# EAGLE design 2009_12_01_sevenSegmentWatch_01_01 (EAGLE 4.16)

## Sheet 1 of 2
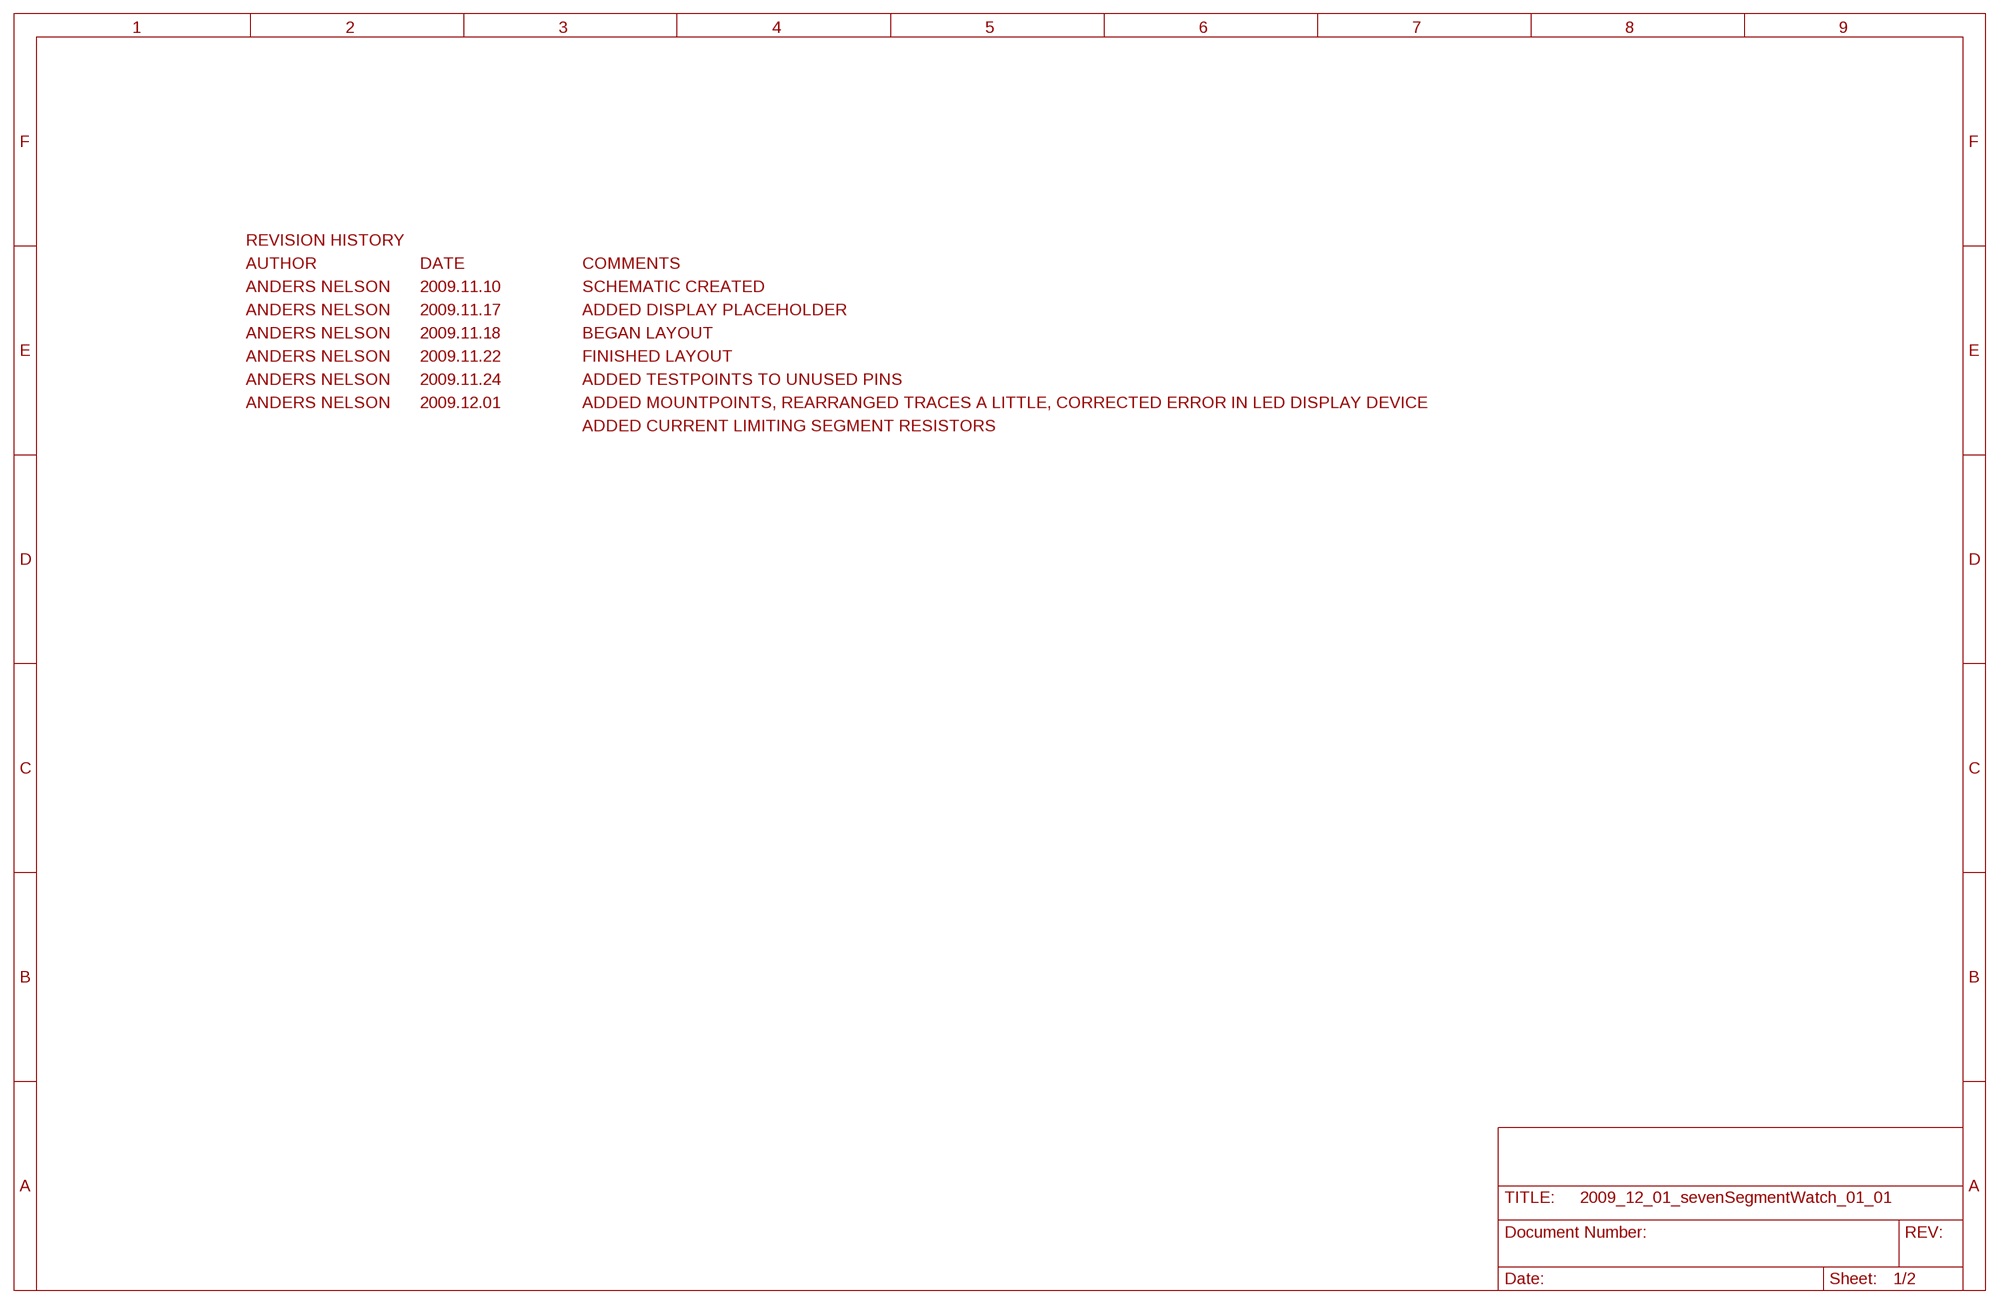
[diagram p0: schematic, sheet 1]

### Notes on the sheet
- REVISION HISTORY
- AUTHOR | DATE | COMMENTS
- ANDERS NELSON | 2009.11.10 | SCHEMATIC CREATED
- ANDERS NELSON | 2009.11.17 | ADDED DISPLAY PLACEHOLDER
- ANDERS NELSON | 2009.11.18 | BEGAN LAYOUT
- ANDERS NELSON | 2009.11.22 | FINISHED LAYOUT
- ANDERS NELSON | 2009.11.24 | ADDED TESTPOINTS TO UNUSED PINS
- ANDERS NELSON | 2009.12.01 | ADDED MOUNTPOINTS, REARRANGED TRACES A LITTLE, CORRECTED ERROR IN LED DISPLAY DEVICE
- ADDED CURRENT LIMITING SEGMENT RESISTORS

## Sheet 2 of 2
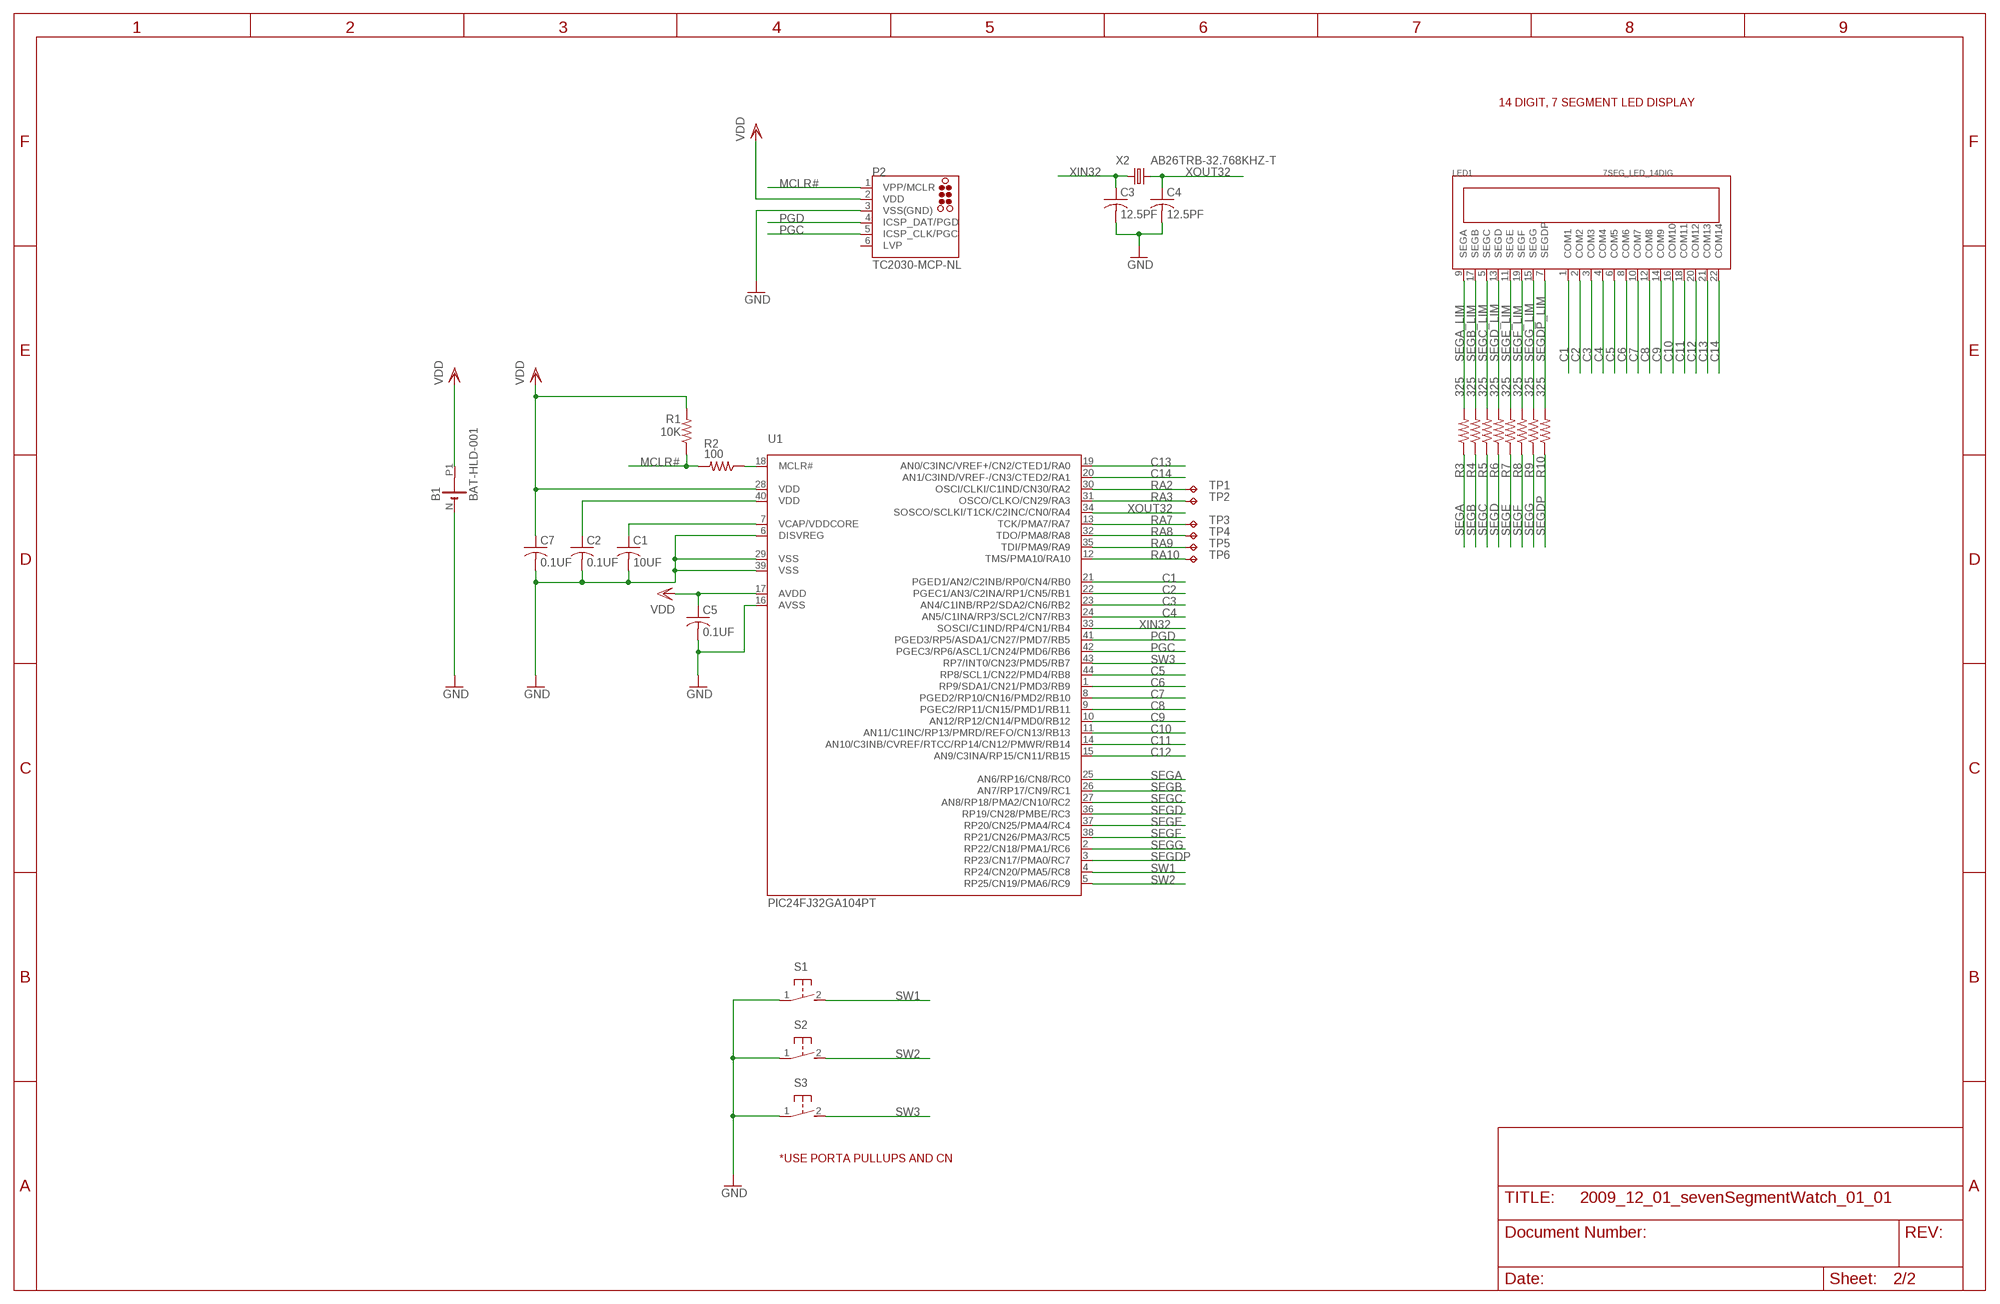
[diagram p1: schematic, sheet 2]

### Parts
B1  BAT-HLD-001  [BAT-HLD-001]
C1  10UF  C-USC0603  [C0603]
C2  0.1UF  C-USC0603  [C0603]
C3  12.5PF  C-USC0603  [C0603]
C4  12.5PF  C-USC0603  [C0603]
C5  0.1UF  C-USC0603  [C0603]
C7  0.1UF  C-USC0603  [C0603]
LED1  7SEG_LED_14DIG  [7SEG_LED_14DIG]
P2  TC2030-MCP-NL  [TC2030-MCP-NL]
R1  10K  R-US_R0603  [R0603]
R2  100  R-US_R0603  [R0603]
R3  325  R-US_R0402  [R0402]
R4  325  R-US_R0402  [R0402]
R5  325  R-US_R0402  [R0402]
R6  325  R-US_R0402  [R0402]
R7  325  R-US_R0402  [R0402]
R8  325  R-US_R0402  [R0402]
R9  325  R-US_R0402  [R0402]
R10  325  R-US_R0402  [R0402]
S1  31-XX  [B3F-31XX]
S2  31-XX  [B3F-31XX]
S3  31-XX  [B3F-31XX]
TP1  TPB1,27  [B1,27]
TP2  TPB1,27  [B1,27]
TP3  TPB1,27  [B1,27]
TP4  TPB1,27  [B1,27]
TP5  TPB1,27  [B1,27]
TP6  TPB1,27  [B1,27]
U1  PIC24FJ32GA104PT  [TQFP44]
X2  AB26TRB-32.768KHZ-T  [CYL_6MM_2MM_SMD]

### Nets
C1: LED1.1(COM1) U1.21(PGED1/AN2/C2INB/RP0/CN4/RB0)
C2: LED1.2(COM2) U1.22(PGEC1/AN3/C2INA/RP1/CN5/RB1)
C3: LED1.3(COM3) U1.23(AN4/C1INB/RP2/SDA2/CN6/RB2)
C4: LED1.4(COM4) U1.24(AN5/C1INA/RP3/SCL2/CN7/RB3)
C5: LED1.6(COM5) U1.44(RP8/SCL1/CN22/PMD4/RB8)
C6: LED1.8(COM6) U1.1(RP9/SDA1/CN21/PMD3/RB9)
C7: LED1.10(COM7) U1.8(PGED2/RP10/CN16/PMD2/RB10)
C8: LED1.12(COM8) U1.9(PGEC2/RP11/CN15/PMD1/RB11)
C9: LED1.14(COM9) U1.10(AN12/RP12/CN14/PMD0/RB12)
C10: LED1.16(COM10) U1.11(AN11/C1INC/RP13/PMRD/REFO/CN13/RB13)
C11: LED1.18(COM11) U1.14(AN10/C3INB/CVREF/RTCC/RP14/CN12/PMWR/RB14)
C12: LED1.20(COM12) U1.15(AN9/C3INA/RP15/CN11/RB15)
C13: LED1.21(COM13) U1.19(AN0/C3INC/VREF+/CN2/CTED1/RA0)
C14: LED1.22(COM14) U1.20(AN1/C3IND/VREF-/CN3/CTED2/RA1)
GND: B1.N(-) C1.2 C2.2 C3.2 C4.2 C5.2 C7.2 P2.3(VSS(GND)) S1.1(P) S2.1(P) S3.1(P) U1.6(DISVREG) U1.16(AVSS) U1.29(VSS) U1.39(VSS)
MCLR#: P2.1(VPP/MCLR) R1.1 R2.2
N$1: C2.1 U1.40(VDD)
N$2: R2.1 U1.18(MCLR#)
N$7: C1.1 U1.7(VCAP/VDDCORE)
PGC: P2.5(ICSP_CLK/PGC) U1.42(PGEC3/RP6/ASCL1/CN24/PMD6/RB6)
PGD: P2.4(ICSP_DAT/PGD) U1.41(PGED3/RP5/ASDA1/CN27/PMD7/RB5)
RA2: TP1.PP(TP) U1.30(OSCI/CLKI/C1IND/CN30/RA2)
RA3: TP2.PP(TP) U1.31(OSCO/CLKO/CN29/RA3)
RA7: TP3.PP(TP) U1.13(TCK/PMA7/RA7)
RA8: TP4.PP(TP) U1.32(TDO/PMA8/RA8)
RA9: TP5.PP(TP) U1.35(TDI/PMA9/RA9)
RA10: TP6.PP(TP) U1.12(TMS/PMA10/RA10)
SEGA: R3.1 U1.25(AN6/RP16/CN8/RC0)
SEGA_LIM: LED1.9(SEGA) R3.2
SEGB: R4.1 U1.26(AN7/RP17/CN9/RC1)
SEGB_LIM: LED1.17(SEGB) R4.2
SEGC: R5.1 U1.27(AN8/RP18/PMA2/CN10/RC2)
SEGC_LIM: LED1.5(SEGC) R5.2
SEGD: R6.1 U1.36(RP19/CN28/PMBE/RC3)
SEGD_LIM: LED1.13(SEGD) R6.2
SEGDP: R10.1 U1.3(RP23/CN17/PMA0/RC7)
SEGDP_LIM: LED1.7(SEGDP) R10.2
SEGE: R7.1 U1.37(RP20/CN25/PMA4/RC4)
SEGE_LIM: LED1.11(SEGE) R7.2
SEGF: R8.1 U1.38(RP21/CN26/PMA3/RC5)
SEGF_LIM: LED1.19(SEGF) R8.2
SEGG: R9.1 U1.2(RP22/CN18/PMA1/RC6)
SEGG_LIM: LED1.15(SEGG) R9.2
SW1: S1.2(S) U1.4(RP24/CN20/PMA5/RC8)
SW2: S2.2(S) U1.5(RP25/CN19/PMA6/RC9)
SW3: S3.2(S) U1.43(RP7/INT0/CN23/PMD5/RB7)
VDD: B1.P1(+) C5.1 C7.1 P2.2(VDD) R1.2 U1.17(AVDD) U1.28(VDD)
XIN32: C3.1 U1.33(SOSCI/C1IND/RP4/CN1/RB4) X2.3
XOUT32: C4.1 U1.34(SOSCO/SCLKI/T1CK/C2INC/CN0/RA4) X2.2
Unconnected: B1.P2(+) P2.6(LVP)

### Notes on the sheet
- 14 DIGIT, 7 SEGMENT LED DISPLAY
- *USE PORTA PULLUPS AND CN

## Library data of the parts
B1 = sevenSegmentWatch:BAT-HLD-001
C1-C5 C7 = rcl:C-US: CAPACITOR, American symbol
LED1 = sevenSegmentWatch:7SEG_LED_14DIG
P2 = raveGearControl:TC2030: TAG-CONNECT ISP Connector Manufacturer: Tag-Connect <www.tag-connect.com> Cable for easy In-Circuit PCB Programming. Designed for Microchip ICD2, suitable for many others. Two variants - one "with legs" (for hads-free fit on PCB) and another "without legs" for quick programming. PAD Description 1 MCLR/Vpp 2 Vdd 3 GND 4 PGD (ISPDAT) 5 PGC (ISPCLK) 6 nc (used for LVP) ©2009 ROFA.cz
R1-R10 = rcl:R-US_: RESISTOR, American symbol
S1-S3 = switch-omron:31-XX: OMRON SWITCH
TP1-TP6 = testpad:TP
U1 = sevenSegmentWatch:PIC24FJ*
X2 = raveGearControl2:AB26TRB-32.768KHZ-T

## Board
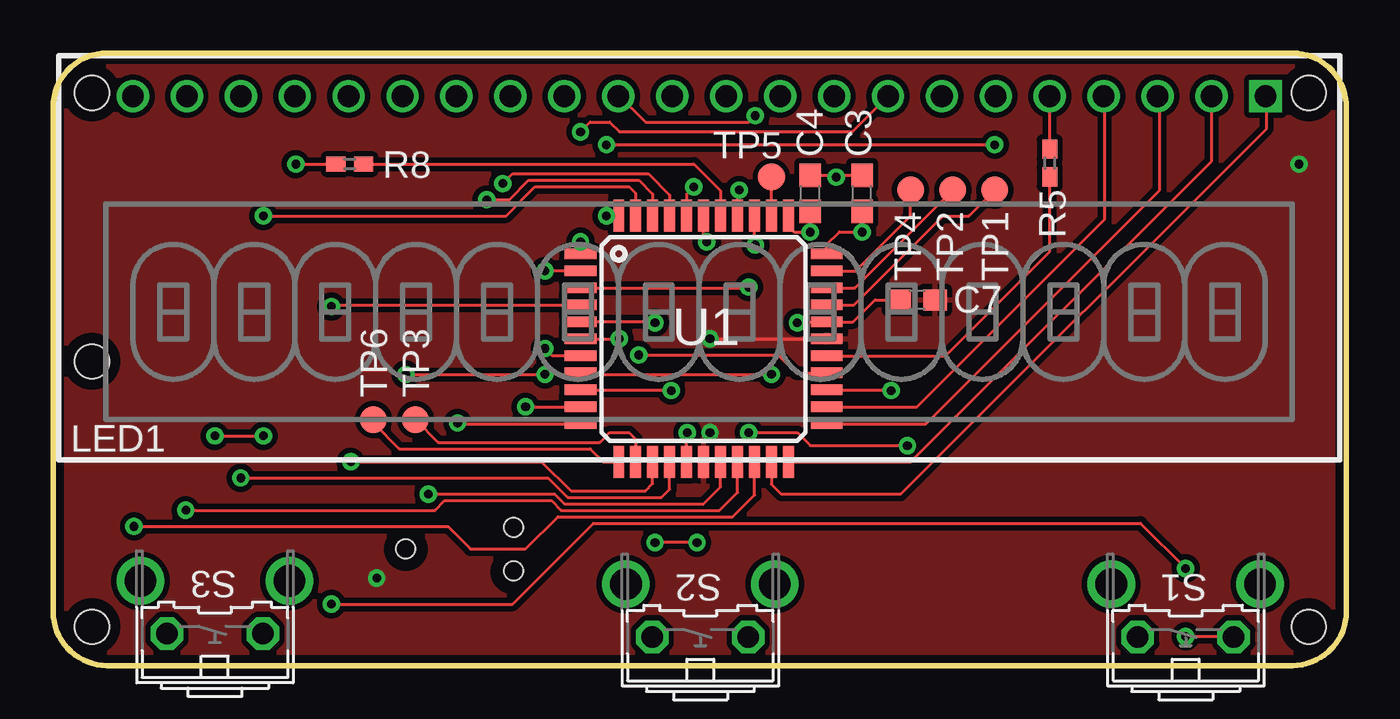
[diagram p2: board, top side]
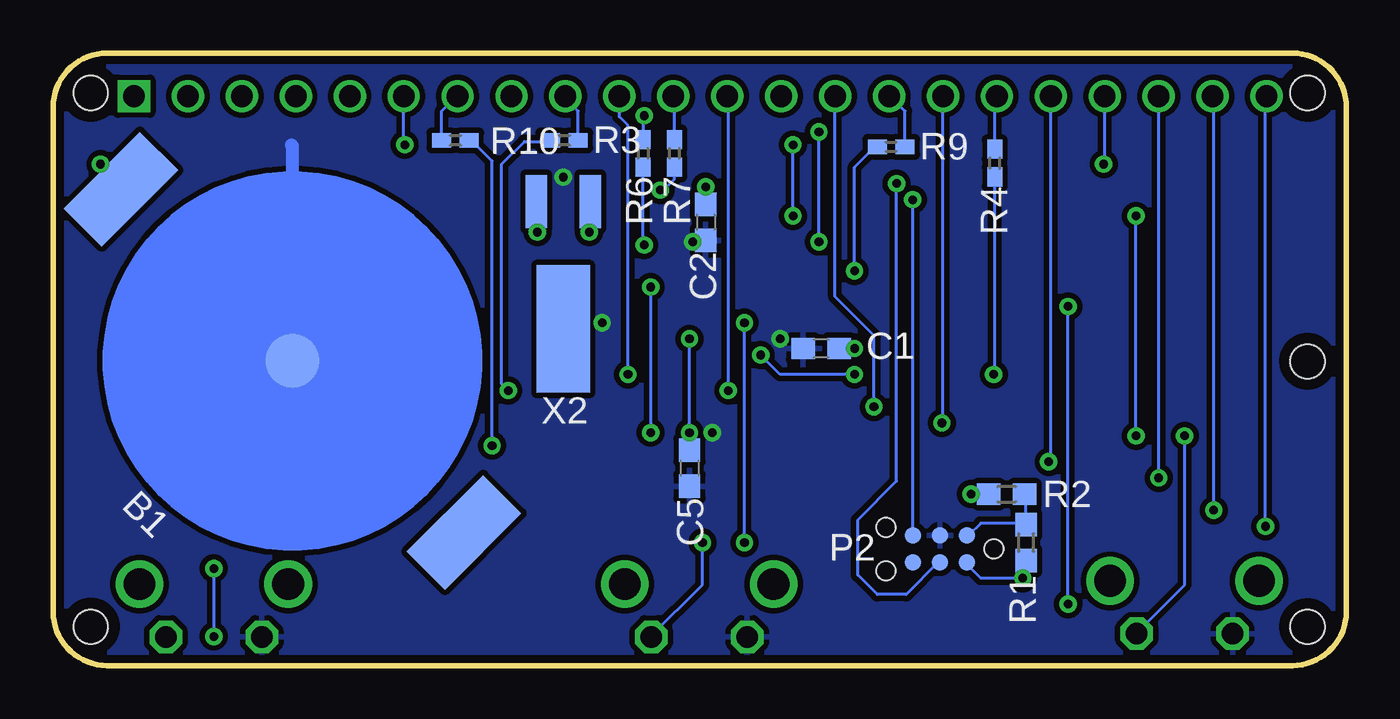
[diagram p3: board, bottom side, seen from below]

Size 60.91 x 28.85 mm. Coordinates in mm from the lower left corner, seen from the top.
Outline: 58.37,0 arc90 60.91,2.54 60.91,26.31 arc90 58.37,28.85 2.54,28.85 arc90 0,26.31 0,2.54 arc90 2.54,0 58.37,0
Copper layers (1*16): Top 0.0356mm / dielectric 0.2007mm / Bottom 0.0356mm
Design rules "PCBExpress_E2": minimum track width 6mil, minimum drill 16mil, track to track 6mil, track to pad 6mil, pad to pad 6mil, via to via 6mil, smd to smd 0mil, copper to edge 15mil, drill to drill 8mil, minimum pad ring 10mil, minimum via ring 8mil, stop-mask expansion 4mil, vias tented up to drill 16mil, thermal gap 10mil
Holes 1.6 mm at 1.83,1.83 59.13,1.83 59.13,26.97 1.83,26.97 1.83,14.33
tRestrict: area 20.9,5.8 to 22.4,7.3; area 20.9,3.6 to 22.4,5.2; area 15.8,4.7 to 17.4,6.3; area 0.8,0.8 to 2.9,2.9; area 58.1,0.8 to 60.2,2.9; area 58.1,25.9 to 60.2,28; area 0.8,25.9 to 2.9,28.1; area 0.8,13.2 to 2.9,15.4
bRestrict: area 20.9,5.8 to 22.4,7.3; area 20.9,3.6 to 22.4,5.2; area 15.8,4.7 to 17.4,6.2; area 0.7,25.9 to 2.9,28.1; area 58,25.9 to 60.2,28.1; area 58,0.7 to 60.2,2.9; area 0.8,0.8 to 2.9,2.9; area 0.8,13.2 to 2.9,15.4

### Footprints (pad centres in the part's own frame; a part is rotated, then mirrored left to right if it is on the bottom)
BAT-HLD-001 = smd 2.54 x 2.54: N 0,0 | smd 2.54 x 5.08: P1 -11.43,0; P2 11.43,0
C0603 = smd 1.1 x 1: 1 -0.85,0; 2 0.85,0
7SEG_LED_14DIG = drill 1.016 square: 1 -26.67,-7.62 | drill 1.016 round: 2 -24.13,-7.62; 3 -21.59,-7.62; 4 -19.05,-7.62; 5 -16.51,-7.62; 6 -13.97,-7.62; 7 -11.43,-7.62; 8 -8.89,-7.62; 9 -6.35,-7.62; 10 -3.81,-7.62; 11 -1.27,-7.62; 12 1.27,-7.62; 13 3.81,-7.62; 14 6.35,-7.62; 15 8.89,-7.62; 16 11.43,-7.62; 17 13.97,-7.62; 18 16.51,-7.62; 19 19.05,-7.62; 20 21.59,-7.62; 21 24.13,-7.62; 22 26.67,-7.62
TC2030-MCP-NL = smd 0.787 x 0.787: 1 1.27,-0.635; 2 1.27,0.635; 3 2.54,-0.635; 4 2.54,0.635; 5 3.81,-0.635; 6 3.81,0.635 | hole 0.889: 0,0; 5.08,-1.016; 5.08,1.016
R0603 = smd 1.1 x 1: 1 -0.85,0; 2 0.85,0
R0402 = smd 0.9 x 0.7: 1 -0.65,0; 2 0.65,0
B3F-31XX = drill 1.016 octagon: 1 -2.261,-1.245; 2 2.261,-1.245 | drill 1.499 pad 2.159 round: 3 -3.505,1.245; 4 3.505,1.245
B1,27 = smd 1.27 x 1.27: PP 0,0
TQFP44 = smd 1.5 x 0.5: 1 -5.8,4; 2 -5.8,3.2; 3 -5.8,2.4; 4 -5.8,1.6; 5 -5.8,0.8; 6 -5.8,0; 7 -5.8,-0.8; 8 -5.8,-1.6; 9 -5.8,-2.4; 10 -5.8,-3.2; 11 -5.8,-4; 23 5.8,-4; 24 5.8,-3.2; 25 5.8,-2.4; 26 5.8,-1.6; 27 5.8,-0.8; 28 5.8,0; 29 5.8,0.8; 30 5.8,1.6; 31 5.8,2.4; 32 5.8,3.2; 33 5.8,4 | smd 0.5 x 1.5: 12 -4,-5.8; 13 -3.2,-5.8; 14 -2.4,-5.8; 15 -1.6,-5.8; 16 -0.8,-5.8; 17 0,-5.8; 18 0.8,-5.8; 19 1.6,-5.8; 20 2.4,-5.8; 21 3.2,-5.8; 22 4,-5.8; 34 4,5.8; 35 3.2,5.8; 36 2.4,5.8; 37 1.6,5.8; 38 0.8,5.8; 39 0,5.8; 40 -0.8,5.8; 41 -1.6,5.8; 42 -2.4,5.8; 43 -3.2,5.8; 44 -4,5.8
CYL_6MM_2MM_SMD = smd 6 x 2.5: 1 -2.125,0 | smd 2.5 x 1: 2 3.875,-1.27; 3 3.875,1.27

### Placement (x,y rotation side)
B1  49.64,14.35 315 bottom
C1  24.74,14.94 180 bottom
C2  30.18,20.88 270 bottom
C3  38.1,22.25 90 top
C4  35.66,22.25 90 top
C5  30.94,9.3 270 bottom
C7  40.69,17.22 180 top
LED1  30.43,19.2 180 top
P2  16.61,5.49 180 bottom
R1  15.09,5.79 270 bottom
R2  16,8.08 0 bottom
R3  36.83,24.74 0 bottom
R4  16.56,23.67 90 bottom
R5  46.94,23.67 90 top
R6  33.12,24.13 90 bottom
R7  31.65,24.13 90 bottom
R8  13.97,23.62 180 top
R9  21.44,24.43 0 bottom
R10  41.96,24.74 180 bottom
S1  53.34,2.59 0 top
S2  30.48,2.59 0 top
S3  7.62,2.74 0 top
TP1  44.35,22.4 0 top
TP2  42.37,22.4 0 top
TP3  17.07,11.58 0 top
TP4  40.39,22.4 0 top
TP5  33.83,23.01 0 top
TP6  15.09,11.58 0 top
U1  30.63,15.39 0 top
X2  36.88,17.98 90 bottom

### Tracks (layer width: path | path; a pad name or v marks a point on that pad's centre or on a via)
C1
  Top 0.152: U1.21 33.83,8.54 34.29,8.08 39.93,8.08 57.15,25.3 57.15,26.82 LED1.1
C2
  Top 0.152: U1.22 40.38,9.59 54.56,23.77 LED1.2
C3
  Top 0.152: U1.23 41.11,11.39 52.12,22.4 52.12,26.67 51.97,26.82 LED1.3
C4
  Top 0.152: U1.24 40.69,12.19 49.53,21.03 49.53,26.82 LED1.4
C5  (via drill 0.41)
  Top 0.152: U1.44 26.07,21.19 v26.06,21.18 | v26.06,24.54 v44.35,24.54
  Bottom 0.152: LED1.6 44.4,24.43 v44.35,24.54 | v26.06,21.18 v26.06,24.54
C6  (via drill 0.41)
  Top 0.152: v24.84,25.15 25.3,25.6 26.21,25.6 26.67,25.15 37.64,25.15 LED1.8 | U1.1 v24.83,19.96 v24.84,19.96
  Bottom 0.152: v24.84,19.96 v24.84,25.15
C7  (via drill 0.41)
  Top 0.152: U1.8 24.83,13.86 24.84,13.87 24.99,13.72 v33.83,13.72
  Bottom 0.152: LED1.10 34.24,25.86 33.83,25.45 v33.83,13.72
C8  (via drill 0.41)
  Top 0.152: U1.9 29.07,12.99 v29.11,12.95
  Bottom 0.152: LED1.12 29.11,26.82 v29.11,12.95
C9  (via drill 0.41)
  Top 0.152: v22.25,12.19 U1.10 | v22.25,12.19
  Bottom 0.152: LED1.14 24.08,17.37 22.25,15.54 v22.25,12.19
C10  (via drill 0.41)
  Top 0.152: v19.05,11.43 18.9,11.43 18.93,11.39 U1.11
  Bottom 0.152: LED1.16 19,11.48 v19.05,11.43
C11  (via drill 0.41)
  Top 0.152: U1.14 28.23,8.57 27.89,8.23 24.38,8.23 23.01,9.6 v14.02,9.6
  Bottom 0.152: LED1.18 13.92,9.65 v14.02,9.6
C12  (via drill 0.41)
  Top 0.152: U1.15 29.03,8.31 28.65,7.92 24.23,7.92 23.32,8.84 v8.84,8.84
  Bottom 0.152: v8.84,8.84 LED1.20
C13  (via drill 0.41)
  Top 0.152: U1.19 32.23,8.15 31.39,7.32 23.93,7.32 23.47,7.77 18.44,7.77 17.98,7.32 v6.25,7.32
  Bottom 0.152: LED1.21 6.3,26.87 6.25,26.82 v6.25,7.32
C14  (via drill 0.41)
  Top 0.152: U1.20 33.03,8.04 32,7.01 23.77,7.01 22.25,5.49 19.66,5.49 18.59,6.55 v3.81,6.55
  Bottom 0.152: LED1.22 3.76,26.87 3.81,26.82 v3.81,6.55
GND  (via drill 0.41)
  Top 0.152: U1.6 v26.67,15.39 | v35.05,16.15 35.09,16.19 U1.29 37.68,16.19 38.71,17.22 C7.2 | U1.39 30.63,20.12 v30.79,19.96 | U1.16 29.83,10.94 v29.87,10.97 | C4.2 36.79,23.1 v36.88,23.01 36.97,23.1 C3.2
  Bottom 0.61: B1.N 49.64,24.49 49.68,24.54
  pour Bottom (isolate 0.254): 0,28.85 60.91,28.85 60.91,0 0,0
MCLR#
  Bottom 0.152: R2.2 15.09,8.08 15.09,6.71 | P2.1 17.8,6.12 17.22,6.71 15.09,6.71 | R1.1 15.09,6.71
N$1  (via drill 0.41)
  Top 0.152: U1.40 29.83,22.21 v30.18,22.55
  Bottom 0.152: C2.1 v30.18,22.55
N$2  (via drill 0.41)
  Top 0.152: U1.18 31.43,8.42 30.63,7.62 24.08,7.62 23.62,8.08 v17.68,8.08
  Bottom 0.152: R2.1 v17.68,8.08
N$7  (via drill 0.41)
  Top 0.152: U1.7 23.51,14.59 v23.16,14.94
  Bottom 0.152: v23.16,14.94 C1.1
PGC  (via drill 0.41)
  Top 0.152: U1.42 28.23,22.21 27.58,22.86 22.4,22.86 21.49,21.95 v20.42,21.95
  Bottom 0.152: 20.42,6.1 P2.5 v20.42,21.95
PGD  (via drill 0.41)
  Top 0.152: U1.41 29.03,22.17 28.04,23.16 21.64,23.16 v21.18,22.71
  Bottom 0.152: P2.4 19.23,4.85 20.73,3.35 22.1,3.35 23.01,4.27 23.01,6.86 21.18,8.69 v21.18,22.71
RA2
  Top 0.152: U1.30 37.72,16.99 41.91,21.18 43.13,21.18 TP1.PP
RA3
  Top 0.152: U1.31 37.76,17.79 TP2.PP
RA7
  Top 0.152: U1.13 27.43,10.67 27.13,10.97 26.21,10.97 25.76,10.52 18.14,10.52 TP3.PP
RA8
  Top 0.152: U1.32 37.8,18.59 40.39,21.18 TP4.PP
RA9
  Top 0.152: U1.35 TP5.PP
RA10
  Top 0.152: U1.12 25.92,9.59 25.3,10.21 16.31,10.21 15.09,11.43 TP6.PP
SEGA  (via drill 0.41)
  Top 0.152: U1.25 39.13,12.99 v39.47,12.95
  Bottom 0.152: v39.47,12.95 39.78,13.26 39.78,23.62 38.71,24.69 37.49,24.69 37.48,24.7 R3.1
SEGA_LIM
  Bottom 0.152: LED1.9 36.88,26.82 36.18,26.12 R3.2
SEGB  (via drill 0.41)
  Top 0.152: U1.26 34.98,13.79 34.14,14.63 v27.58,14.63 | v16.61,13.72 v23.16,13.72
  Bottom 0.152: v27.58,14.63 26.67,13.72 v23.16,13.72 | R4.1 16.56,13.82 v16.61,13.72
SEGB_LIM
  Bottom 0.152: LED1.17 16.46,26.67 16.56,26.57 R4.2
SEGC
  Top 0.152: U1.27 42.02,14.59 46.94,19.51 R5.1
SEGC_LIM
  Top 0.152: R5.2 LED1.5
SEGD  (via drill 0.41)
  Top 0.152: U1.36 33.03,19.85 v33.07,19.81
  Bottom 0.152: R6.1 33.12,19.86 v33.07,19.81
SEGD_LIM  (via drill 0.41)
  Top 0.152: v33.07,25.91 32.77,25.6 27.89,25.6 26.67,26.82 LED1.13
  Bottom 0.152: R6.2 33.12,25.86 v33.07,25.91
SEGDP  (via drill 0.41)
  Top 0.152: U1.3 32.73,17.79 v32.77,17.83 | v32.77,10.97 35.05,10.97 35.66,10.36 v40.23,10.36
  Bottom 0.152: v32.77,17.83 v32.77,10.97 | R10.1 41.2,24.74 40.23,23.77 v40.23,10.36
SEGDP_LIM
  Bottom 0.152: LED1.7 41.91,26.82 42.61,26.12 R10.2
SEGE  (via drill 0.41)
  Top 0.152: U1.37 32.23,22.33 v32.31,22.4
  Bottom 0.152: v32.31,22.4 32.16,22.4 31.65,22.91 R7.1
SEGE_LIM
  Bottom 0.152: R7.2 31.65,26.77 LED1.11
SEGF
  Top 0.152: U1.38 31.43,22.36 30.18,23.62 R8.1
SEGF_LIM  (via drill 0.41)
  Top 0.152: v11.43,23.62 R8.2
  Bottom 0.152: LED1.19 11.38,23.67 v11.43,23.62
SEGG  (via drill 0.41)
  Top 0.152: U1.2 v23.16,18.59
  Bottom 0.152: v23.16,18.59 23.16,23.47 22.2,24.43 R9.1
SEGG_LIM
  Bottom 0.152: LED1.15 21.49,26.82 20.79,26.12 R9.2
SW1  (via drill 0.41)
  Top 0.152: U1.4 13.18,16.99 v13.11,16.92 | v13.11,2.9 21.64,2.9 25.45,6.71 51.21,6.71 v53.34,4.57 | S1.2 55.63,1.37 v53.34,1.37
  Bottom 0.152: v13.11,2.9 v13.11,16.92 | v53.34,4.57 v53.34,1.37
SW2  (via drill 0.41)
  Top 0.152: U1.5 28.31,16.19 v28.35,16.15 | v30.33,5.79 v28.35,5.79
  Bottom 0.152: v28.35,5.79 v28.35,16.15 | S2.2 32.77,1.37 30.33,3.81 v30.33,5.79
SW3  (via drill 0.41)
  Top 0.152: U1.43 27.43,22.25 27.13,22.55 22.71,22.55 21.34,21.18 v9.91,21.18 | v7.62,10.82 v9.91,10.82
  Bottom 0.152: v9.91,10.82 v9.91,21.18 | S3.2 9.88,1.55 7.62,3.81 v7.62,10.82
VDD  (via drill 0.41)
  Top 0.152: v30.94,15.39 U1.28
  Bottom 0.152: v15.24,4.12 17.22,4.12 17.96,4.85 | v15.24,4.12 15.18,4.2 | 17.96,4.85 17.98,4.88 | 17.96,4.85 P2.2 | v15.24,4.12 15.09,4.27 R1.2 | C5.1 v30.94,10.97 v30.94,15.39
  Bottom 0.61: B1.P1 57.72,22.67 v58.67,23.62
  pour Top (isolate 0.254): 0,28.85 60.91,28.85 60.91,0 0,0
XIN32  (via drill 0.41)
  Top 0.152: U1.33 36.43,19.82 37.03,20.42 v38.1,20.42 C3.1
  Bottom 0.152: X2.3 38.15,20.47 v38.1,20.42
XOUT32  (via drill 0.41)
  Top 0.152: U1.34 34.63,20.69 34.9,20.42 v35.66,20.42 C4.1
  Bottom 0.152: X2.2 35.61,20.47 v35.66,20.42

### Text on the board
Document: (C) 2009 AKN | DISPLAY | ADJUST